# EasyEDA Pro project 重力怀表.epro, board PCB17
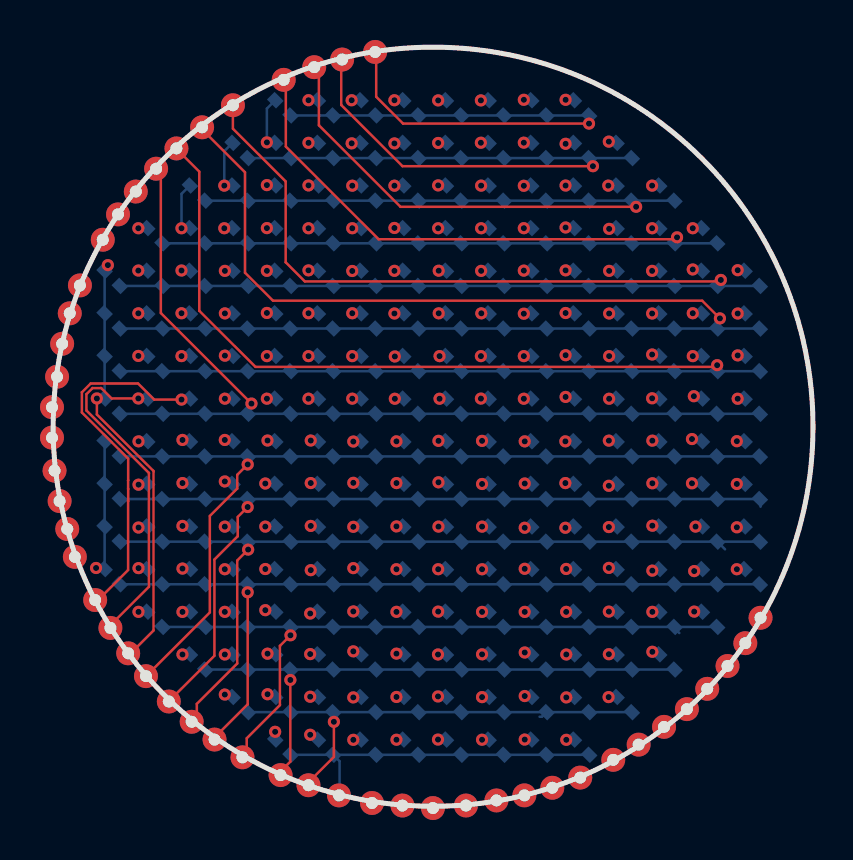
[diagram p3: board, top side]
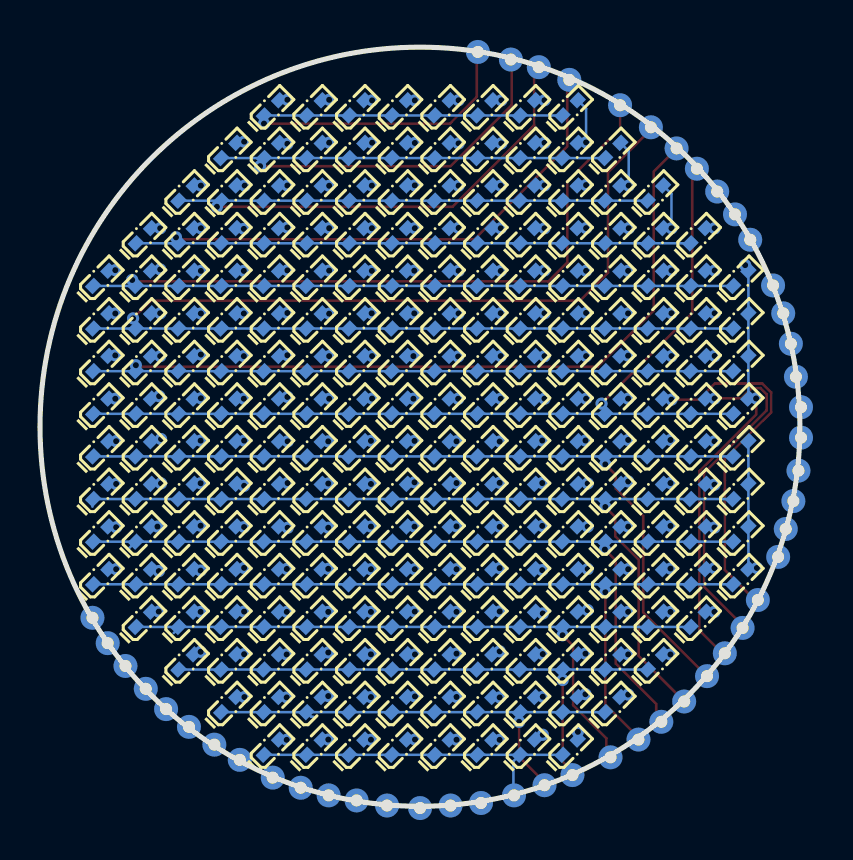
[diagram p4: board, bottom side, seen from below]

Outline 38 x 38 mm; copper layers: Top Layer, Inner1, Inner2, Bottom Layer. Coordinates in mm from the lower left corner of the outline.
Outline path: circle c19,19 r19
Stack: Top Layer 0.035mm / Dielectric1 1.51mm FR4 er 4.5 / Inner1 0.035mm / Dielectric2 0.48mm PP er 4.5 / Inner2 0.035mm / Dielectric3 0.48mm PP er 4.5 / Bottom Layer 0.035mm

## Design rules (mm)
template: JLCPCB Capability(Two Layers Board)
spacing copperThickness1oz (default): track to track 0.102, other pairs 0.152 to 0.3
spacing copperThickness2oz: track to track 0.203, other pairs 0.152 to 0.3
track width copperThickness1oz (default): min 0.127, default 0.254, max 2.54
track width copperThickness2oz: min 0.203, default 0.254, max 2.54
differential pair differentialPair (default): width min 0.127, default 0.254, max 2.54; gap min 0.152, default 0.152
via viaSize (default): diameter min 0.5, default 0.61, max 10; hole min 0.3, default 0.305, max 6.3

## Placement (name value [footprint] x y rotation side)
LED5  -  [LED_0402]  26.43 34.96 135 bottom
LED6  -  [LED_0402]  24.29 34.96 135 bottom
LED7  -  [LED_0402]  22.16 34.96 135 bottom
LED8  -  [LED_0402]  20.02 34.96 135 bottom
LED9  -  [LED_0402]  17.89 34.96 135 bottom
LED10  -  [LED_0402]  15.76 34.96 135 bottom
LED11  -  [LED_0402]  13.62 34.96 135 bottom
LED12  -  [LED_0402]  11.49 34.96 135 bottom
LED20  -  [LED_0402]  28.56 32.83 135 bottom
LED21  -  [LED_0402]  26.43 32.83 135 bottom
LED22  -  [LED_0402]  24.29 32.83 135 bottom
LED23  -  [LED_0402]  22.16 32.83 135 bottom
LED24  -  [LED_0402]  20.02 32.83 135 bottom
LED25  -  [LED_0402]  17.89 32.83 135 bottom
LED26  -  [LED_0402]  15.76 32.83 135 bottom
LED27  -  [LED_0402]  13.62 32.83 135 bottom
LED28  -  [LED_0402]  11.49 32.83 135 bottom
LED29  -  [LED_0402]  9.36 32.83 135 bottom
LED35  -  [LED_0402]  30.69 30.7 135 bottom
LED36  -  [LED_0402]  28.56 30.7 135 bottom
LED37  -  [LED_0402]  26.43 30.7 135 bottom
LED38  -  [LED_0402]  24.29 30.7 135 bottom
LED39  -  [LED_0402]  22.16 30.7 135 bottom
LED40  -  [LED_0402]  20.02 30.7 135 bottom
LED41  -  [LED_0402]  17.89 30.7 135 bottom
LED42  -  [LED_0402]  15.76 30.7 135 bottom
LED43  -  [LED_0402]  13.62 30.7 135 bottom
LED44  -  [LED_0402]  11.49 30.7 135 bottom
LED45  -  [LED_0402]  9.36 30.7 135 bottom
LED46  -  [LED_0402]  7.22 30.7 135 bottom
LED50  -  [LED_0402]  32.83 28.56 135 bottom
LED51  -  [LED_0402]  30.69 28.56 135 bottom
LED52  -  [LED_0402]  28.56 28.56 135 bottom
LED53  -  [LED_0402]  26.43 28.56 135 bottom
LED54  -  [LED_0402]  24.29 28.56 135 bottom
LED55  -  [LED_0402]  22.16 28.56 135 bottom
LED56  -  [LED_0402]  20.02 28.56 135 bottom
LED57  -  [LED_0402]  17.89 28.56 135 bottom
LED58  -  [LED_0402]  15.76 28.56 135 bottom
LED59  -  [LED_0402]  13.62 28.56 135 bottom
LED60  -  [LED_0402]  11.49 28.56 135 bottom
LED61  -  [LED_0402]  9.36 28.56 135 bottom
LED62  -  [LED_0402]  7.22 28.56 135 bottom
LED63  -  [LED_0402]  5.09 28.56 135 bottom
LED65  -  [LED_0402]  34.96 26.43 135 bottom
LED66  -  [LED_0402]  32.83 26.43 135 bottom
LED67  -  [LED_0402]  30.69 26.43 135 bottom
LED68  -  [LED_0402]  28.56 26.43 135 bottom
LED69  -  [LED_0402]  26.43 26.43 135 bottom
LED70  -  [LED_0402]  24.29 26.43 135 bottom
LED71  -  [LED_0402]  22.16 26.43 135 bottom
LED72  -  [LED_0402]  20.02 26.43 135 bottom
LED73  -  [LED_0402]  17.89 26.43 135 bottom
LED74  -  [LED_0402]  15.76 26.43 135 bottom
LED75  -  [LED_0402]  13.62 26.43 135 bottom
LED76  -  [LED_0402]  11.49 26.43 135 bottom
LED77  -  [LED_0402]  9.36 26.43 135 bottom
LED78  -  [LED_0402]  7.22 26.43 135 bottom
LED79  -  [LED_0402]  5.09 26.43 135 bottom
LED80  -  [LED_0402]  2.96 26.43 135 bottom
LED81  -  [LED_0402]  34.96 24.3 135 bottom
LED82  -  [LED_0402]  32.83 24.3 135 bottom
LED83  -  [LED_0402]  30.69 24.3 135 bottom
LED84  -  [LED_0402]  28.56 24.3 135 bottom
LED85  -  [LED_0402]  26.43 24.3 135 bottom
LED86  -  [LED_0402]  24.29 24.3 135 bottom
LED87  -  [LED_0402]  22.16 24.3 135 bottom
LED88  -  [LED_0402]  20.02 24.3 135 bottom
LED89  -  [LED_0402]  17.89 24.3 135 bottom
LED90  -  [LED_0402]  15.76 24.3 135 bottom
LED91  -  [LED_0402]  13.62 24.3 135 bottom
LED92  -  [LED_0402]  11.49 24.3 135 bottom
LED93  -  [LED_0402]  9.36 24.3 135 bottom
LED94  -  [LED_0402]  7.22 24.3 135 bottom
LED95  -  [LED_0402]  5.09 24.3 135 bottom
LED96  -  [LED_0402]  2.96 24.3 135 bottom
LED97  -  [LED_0402]  34.96 22.16 135 bottom
LED98  -  [LED_0402]  32.83 22.16 135 bottom
LED99  -  [LED_0402]  30.69 22.16 135 bottom
LED100  -  [LED_0402]  28.56 22.16 135 bottom
LED101  -  [LED_0402]  26.43 22.16 135 bottom
LED102  -  [LED_0402]  24.29 22.16 135 bottom
LED103  -  [LED_0402]  22.16 22.16 135 bottom
LED104  -  [LED_0402]  20.02 22.16 135 bottom
LED105  -  [LED_0402]  17.89 22.16 135 bottom
LED106  -  [LED_0402]  15.76 22.16 135 bottom
LED107  -  [LED_0402]  13.62 22.16 135 bottom
LED108  -  [LED_0402]  11.49 22.16 135 bottom
LED109  -  [LED_0402]  9.36 22.16 135 bottom
LED110  -  [LED_0402]  7.22 22.16 135 bottom
LED111  -  [LED_0402]  5.09 22.16 135 bottom
LED112  -  [LED_0402]  2.96 22.16 135 bottom
LED113  -  [LED_0402]  34.96 20.03 135 bottom
LED114  -  [LED_0402]  32.83 20.03 135 bottom
LED115  -  [LED_0402]  30.69 20.03 135 bottom
LED116  -  [LED_0402]  28.56 20.03 135 bottom
LED117  -  [LED_0402]  26.43 20.03 135 bottom
LED118  -  [LED_0402]  24.29 20.03 135 bottom
LED119  -  [LED_0402]  22.16 20.03 135 bottom
LED120  -  [LED_0402]  20.02 20.03 135 bottom
LED121  -  [LED_0402]  17.89 20.03 135 bottom
LED122  -  [LED_0402]  15.76 20.03 135 bottom
LED123  -  [LED_0402]  13.62 20.03 135 bottom
LED124  -  [LED_0402]  11.49 20.03 135 bottom
LED125  -  [LED_0402]  9.36 20.03 135 bottom
LED126  -  [LED_0402]  7.22 20.03 135 bottom
LED127  -  [LED_0402]  5.09 20.03 135 bottom
LED128  -  [LED_0402]  2.96 20.03 135 bottom
LED129  -  [LED_0402]  34.96 17.89 135 bottom
LED130  -  [LED_0402]  32.83 17.89 135 bottom
LED131  -  [LED_0402]  30.69 17.89 135 bottom
LED132  -  [LED_0402]  28.56 17.89 135 bottom
LED133  -  [LED_0402]  26.43 17.89 135 bottom
LED134  -  [LED_0402]  24.29 17.89 135 bottom
LED135  -  [LED_0402]  22.16 17.89 135 bottom
LED136  -  [LED_0402]  20.02 17.89 135 bottom
LED137  -  [LED_0402]  17.89 17.89 135 bottom
LED138  -  [LED_0402]  15.76 17.89 135 bottom
LED139  -  [LED_0402]  13.62 17.89 135 bottom
LED140  -  [LED_0402]  11.49 17.89 135 bottom
LED141  -  [LED_0402]  9.36 17.89 135 bottom
LED142  -  [LED_0402]  7.22 17.89 135 bottom
LED143  -  [LED_0402]  5.09 17.89 135 bottom
LED144  -  [LED_0402]  2.96 17.89 135 bottom
LED145  -  [LED_0402]  34.96 15.76 135 bottom
LED146  -  [LED_0402]  32.83 15.76 135 bottom
LED147  -  [LED_0402]  30.69 15.76 135 bottom
LED148  -  [LED_0402]  28.56 15.76 135 bottom
LED149  -  [LED_0402]  26.43 15.76 135 bottom
LED150  -  [LED_0402]  24.29 15.76 135 bottom
LED151  -  [LED_0402]  22.16 15.76 135 bottom
LED152  -  [LED_0402]  20.02 15.76 135 bottom
LED153  -  [LED_0402]  17.89 15.76 135 bottom
LED154  -  [LED_0402]  15.76 15.76 135 bottom
LED155  -  [LED_0402]  13.62 15.76 135 bottom
LED156  -  [LED_0402]  11.49 15.76 135 bottom
LED157  -  [LED_0402]  9.36 15.76 135 bottom
LED158  -  [LED_0402]  7.22 15.76 135 bottom
LED159  -  [LED_0402]  5.09 15.76 135 bottom
LED160  -  [LED_0402]  2.96 15.76 135 bottom
LED161  -  [LED_0402]  34.96 13.63 135 bottom
LED162  -  [LED_0402]  32.83 13.63 135 bottom
LED163  -  [LED_0402]  30.69 13.63 135 bottom
LED164  -  [LED_0402]  28.56 13.63 135 bottom
LED165  -  [LED_0402]  26.43 13.63 135 bottom
LED166  -  [LED_0402]  24.29 13.63 135 bottom
LED167  -  [LED_0402]  22.16 13.63 135 bottom
LED168  -  [LED_0402]  20.02 13.63 135 bottom
LED169  -  [LED_0402]  17.89 13.63 135 bottom
LED170  -  [LED_0402]  15.76 13.63 135 bottom
LED171  -  [LED_0402]  13.62 13.63 135 bottom
LED172  -  [LED_0402]  11.49 13.63 135 bottom
LED173  -  [LED_0402]  9.36 13.63 135 bottom
LED174  -  [LED_0402]  7.22 13.63 135 bottom
LED175  -  [LED_0402]  5.09 13.63 135 bottom
LED176  -  [LED_0402]  2.96 13.63 135 bottom
LED177  -  [LED_0402]  34.96 11.49 135 bottom
LED178  -  [LED_0402]  32.83 11.49 135 bottom
LED179  -  [LED_0402]  30.69 11.49 135 bottom
LED180  -  [LED_0402]  28.56 11.49 135 bottom
LED181  -  [LED_0402]  26.43 11.49 135 bottom
LED182  -  [LED_0402]  24.29 11.49 135 bottom
LED183  -  [LED_0402]  22.16 11.49 135 bottom
LED184  -  [LED_0402]  20.02 11.49 135 bottom
LED185  -  [LED_0402]  17.89 11.49 135 bottom
LED186  -  [LED_0402]  15.76 11.49 135 bottom
LED187  -  [LED_0402]  13.62 11.49 135 bottom
LED188  -  [LED_0402]  11.49 11.49 135 bottom
LED189  -  [LED_0402]  9.36 11.49 135 bottom
LED190  -  [LED_0402]  7.22 11.49 135 bottom
LED191  -  [LED_0402]  5.09 11.49 135 bottom
LED192  -  [LED_0402]  2.96 11.49 135 bottom
LED194  -  [LED_0402]  32.83 9.36 135 bottom
LED195  -  [LED_0402]  30.69 9.36 135 bottom
LED196  -  [LED_0402]  28.56 9.36 135 bottom
LED197  -  [LED_0402]  26.43 9.36 135 bottom
LED198  -  [LED_0402]  24.29 9.36 135 bottom
LED199  -  [LED_0402]  22.16 9.36 135 bottom
LED200  -  [LED_0402]  20.02 9.36 135 bottom
LED201  -  [LED_0402]  17.89 9.36 135 bottom
LED202  -  [LED_0402]  15.76 9.36 135 bottom
LED203  -  [LED_0402]  13.62 9.36 135 bottom
LED204  -  [LED_0402]  11.49 9.36 135 bottom
LED205  -  [LED_0402]  9.36 9.36 135 bottom
LED206  -  [LED_0402]  7.22 9.36 135 bottom
LED207  -  [LED_0402]  5.09 9.36 135 bottom
LED211  -  [LED_0402]  30.69 7.23 135 bottom
LED212  -  [LED_0402]  28.56 7.23 135 bottom
LED213  -  [LED_0402]  26.43 7.23 135 bottom
LED214  -  [LED_0402]  24.29 7.23 135 bottom
LED215  -  [LED_0402]  22.16 7.23 135 bottom
LED216  -  [LED_0402]  20.02 7.23 135 bottom
LED217  -  [LED_0402]  17.89 7.23 135 bottom
LED218  -  [LED_0402]  15.76 7.23 135 bottom
LED219  -  [LED_0402]  13.62 7.23 135 bottom
LED220  -  [LED_0402]  11.49 7.23 135 bottom
LED221  -  [LED_0402]  9.36 7.23 135 bottom
LED222  -  [LED_0402]  7.22 7.23 135 bottom
LED228  -  [LED_0402]  28.56 5.09 135 bottom
LED229  -  [LED_0402]  26.43 5.09 135 bottom
LED230  -  [LED_0402]  24.29 5.09 135 bottom
LED231  -  [LED_0402]  22.16 5.09 135 bottom
LED232  -  [LED_0402]  20.02 5.09 135 bottom
LED233  -  [LED_0402]  17.89 5.09 135 bottom
LED234  -  [LED_0402]  15.76 5.09 135 bottom
LED235  -  [LED_0402]  13.62 5.09 135 bottom
LED236  -  [LED_0402]  11.49 5.09 135 bottom
LED237  -  [LED_0402]  9.36 5.09 135 bottom
LED245  -  [LED_0402]  26.43 2.96 135 bottom
LED246  -  [LED_0402]  24.29 2.96 135 bottom
LED247  -  [LED_0402]  22.16 2.96 135 bottom
LED248  -  [LED_0402]  20.02 2.96 135 bottom
LED249  -  [LED_0402]  17.89 2.96 135 bottom
LED250  -  [LED_0402]  15.76 2.96 135 bottom
LED251  -  [LED_0402]  13.62 2.96 135 bottom
LED252  -  [LED_0402]  11.49 2.96 135 bottom
NOREF  -  [Pad_e873]  2.87 8.93 0 top
NOREF#2  -  [Pad_e881]  6.93 4.23 0 top
NOREF#3  -  [Pad_e874]  3.25 29.63 0 top
NOREF#4  -  [Pad_e872]  2.48 28.36 0 top
NOREF#5  -  [Pad_e898]  23.57 0.55 0 top
NOREF#6  -  [Pad_e894]  17.47 0.04 0 top
NOREF#7  -  [Pad_e884]  8.99 35.09 0 top
NOREF#8  -  [Pad_e870]  1.34 26.07 0 top
NOREF#9  -  [Pad_e887]  11.53 36.36 0 top
NOREF#10  -  [Pad_e878]  5.15 31.92 0 top
NOREF#11  -  [Pad_e902]  29.28 3.09 0 top
NOREF#12  -  [Pad_e895]  18.99 -0.09 0 top
NOREF#13  -  [Pad_e885]  9.47 2.45 0 top
NOREF#14  -  [Pad_e868]  0.83 24.68 0 top
NOREF#15  -  [Pad_e882]  7.45 33.99 0 top
NOREF#16  -  [Pad_e863]  0.07 16.8 0 top
NOREF#17  -  [Pad_e871]  2.1 10.33 0 top
NOREF#18  -  [Pad_e907]  34.62 8.17 0 top
NOREF#19  -  [Pad_e867]  0.71 13.88 0 top
NOREF#20  -  [Pad_e899]  24.96 0.93 0 top
NOREF#21  -  [Pad_e880]  6.17 32.93 0 top
NOREF#22  -  [Pad_e865]  0.33 15.28 0 top
NOREF#23  -  [Pad_e861]  -0.06 19.98 0 top
NOREF#24  -  [Pad_e886]  11.37 1.56 0 top
NOREF#25  -  [Pad_e892]  15.95 0.17 0 top
NOREF#26  -  [Pad_e893]  16.1 37.76 0 top
NOREF#27  -  [Pad_e862]  -0.06 18.45 0 top
NOREF#28  -  [Pad_e903]  30.55 3.98 0 top
NOREF#29  -  [Pad_e866]  0.45 23.15 0 top
NOREF#30  -  [Pad_e901]  28.01 2.32 0 top
NOREF#31  -  [Pad_e900]  26.36 1.44 0 top
NOREF#32  -  [Pad_e883]  8.07 3.34 0 top
NOREF#33  -  [Pad_e889]  13.06 37 0 top
NOREF#34  -  [Pad_e869]  1.09 12.48 0 top
NOREF#35  -  [Pad_e888]  12.77 1.05 0 top
NOREF#36  -  [Pad_e864]  0.2 21.5 0 top
NOREF#37  -  [Pad_e906]  33.73 7.02 0 top
NOREF#38  -  [Pad_e905]  32.71 5.88 0 top
NOREF#39  -  [Pad_e896]  20.65 0.04 0 top
NOREF#40  -  [Pad_e904]  31.69 4.86 0 top
NOREF#41  -  [Pad_e890]  14.3 0.55 0 top
NOREF#42  -  [Pad_e877]  4.64 6.52 0 top
NOREF#43  -  [Pad_e908]  35.38 9.44 0 top
NOREF#44  -  [Pad_e879]  5.79 5.25 0 top
NOREF#45  -  [Pad_e891]  14.45 37.38 0 top
NOREF#46  -  [Pad_e875]  3.75 7.66 0 top
NOREF#47  -  [Pad_e876]  4.14 30.77 0 top
NOREF#48  -  [Pad_e897]  22.17 0.29 0 top

## Footprints (pads in the part's own frame, mm; a bottom-side part is the same pattern mirrored in y, then rotated)
LED_0402
  rect 0.637x0.541 smd: 1(-0.538,0) 2(0.538,0)
Pad_e861
  round 1.2 hole 0.6: 8(0,0)
Pad_e862
  round 1.2 hole 0.6: 7(0,0)
Pad_e863
  round 1.2 hole 0.6: 6(0,0)
Pad_e864
  round 1.2 hole 0.6: 9(0,0)
Pad_e865
  round 1.2 hole 0.6: 5(0,0)
Pad_e866
  round 1.2 hole 0.6: 10(0,0)
Pad_e867
  round 1.2 hole 0.6: 4(0,0)
Pad_e868
  round 1.2 hole 0.6: 11(0,0)
Pad_e869
  round 1.2 hole 0.6: 3(0,0)
Pad_e870
  round 1.2 hole 0.6: 12(0,0)
Pad_e871
  round 1.2 hole 0.6: 2(0,0)
Pad_e872
  round 1.2 hole 0.6: 13(0,0)
Pad_e873
  round 1.2 hole 0.6: 1(0,0)
Pad_e874
  round 1.2 hole 0.6: 14(0,0)
Pad_e875
  round 1.2 hole 0.6: 1(0,0)
Pad_e876
  round 1.2 hole 0.6: 15(0,0)
Pad_e877
  round 1.2 hole 0.6: 5(0,0)
Pad_e878
  round 1.2 hole 0.6: 1(0,0)
Pad_e879
  round 1.2 hole 0.6: 4(0,0)
Pad_e880
  round 1.2 hole 0.6: 2(0,0)
Pad_e881
  round 1.2 hole 0.6: 3(0,0)
Pad_e882
  round 1.2 hole 0.6: 3(0,0)
Pad_e883
  round 1.2 hole 0.6: 2(0,0)
Pad_e884
  round 1.2 hole 0.6: 4(0,0)
Pad_e885
  round 1.2 hole 0.6: 1(0,0)
Pad_e886
  round 1.2 hole 0.6: 3(0,0)
Pad_e887
  round 1.2 hole 0.6: 5(0,0)
Pad_e888
  round 1.2 hole 0.6: 2(0,0)
Pad_e889
  round 1.2 hole 0.6: 6(0,0)
Pad_e890
  round 1.2 hole 0.6: 1(0,0)
Pad_e891
  round 1.2 hole 0.6: 7(0,0)
Pad_e892
  round 1.2 hole 0.6: 15(0,0)
Pad_e893
  round 1.2 hole 0.6: 8(0,0)
Pad_e894
  round 1.2 hole 0.6: 14(0,0)
Pad_e895
  round 1.2 hole 0.6: 13(0,0)
Pad_e896
  round 1.2 hole 0.6: 12(0,0)
Pad_e897
  round 1.2 hole 0.6: 11(0,0)
Pad_e898
  round 1.2 hole 0.6: 10(0,0)
Pad_e899
  round 1.2 hole 0.6: 9(0,0)
Pad_e900
  round 1.2 hole 0.6: 8(0,0)
Pad_e901
  round 1.2 hole 0.6: 7(0,0)
Pad_e902
  round 1.2 hole 0.6: 6(0,0)
Pad_e903
  round 1.2 hole 0.6: 5(0,0)
Pad_e904
  round 1.2 hole 0.6: 4(0,0)
Pad_e905
  round 1.2 hole 0.6: 3(0,0)
Pad_e906
  round 1.2 hole 0.6: 2(0,0)
Pad_e907
  round 1.2 hole 0.6: 2(0,0)
Pad_e908
  round 1.2 hole 0.6: 1(0,0)

## Nets
2R0: LED129.2 LED145.2 LED161.2 LED177.2 NOREF#43.1
2R1: LED130.2 LED146.2 LED162.2 LED178.2 LED194.2 NOREF#18.2
2R2: LED131.2 LED147.2 LED163.2 LED179.2 LED195.2 LED211.2 NOREF#37.2
2R3: LED132.2 LED148.2 LED164.2 LED180.2 LED196.2 LED212.2 LED228.2 NOREF#38.3
2R4: LED133.2 LED149.2 LED165.2 LED181.2 LED197.2 LED213.2 LED229.2 LED245.2 NOREF#40.4
2R5: LED134.2 LED150.2 LED166.2 LED182.2 LED198.2 LED214.2 LED230.2 LED246.2 NOREF#28.5
2R6: LED135.2 LED151.2 LED167.2 LED183.2 LED199.2 LED215.2 LED231.2 LED247.2 NOREF#11.6
2R7: LED136.2 LED152.2 LED168.2 LED184.2 LED200.2 LED216.2 LED232.2 LED248.2 NOREF#30.7
2R8: LED137.2 LED153.2 LED169.2 LED185.2 LED201.2 LED217.2 LED233.2 LED249.2 NOREF#31.8
2R9: LED138.2 LED154.2 LED170.2 LED186.2 LED202.2 LED218.2 LED234.2 LED250.2 NOREF#20.9
2R10: LED139.2 LED155.2 LED171.2 LED187.2 LED203.2 LED219.2 LED235.2 LED251.2 NOREF#5.10
2R11: LED140.2 LED156.2 LED172.2 LED188.2 LED204.2 LED220.2 LED236.2 LED252.2 NOREF#48.11
2R12: LED141.2 LED157.2 LED173.2 LED189.2 LED205.2 LED221.2 LED237.2 NOREF#39.12
2R13: LED142.2 LED158.2 LED174.2 LED190.2 LED206.2 LED222.2 NOREF#12.13
2R14: LED143.2 LED159.2 LED175.2 LED191.2 LED207.2 NOREF#6.14
2R15: LED144.2 LED160.2 LED176.2 LED192.2 NOREF#25.15
C0: LED5.1 LED6.1 LED7.1 LED8.1 LED9.1 LED10.1 LED11.1 LED12.1 NOREF#26.8
C1: LED20.1 LED21.1 LED22.1 LED23.1 LED24.1 LED25.1 LED26.1 LED27.1 LED28.1 LED29.1 NOREF#45.7
C2: LED35.1 LED36.1 LED37.1 LED38.1 LED39.1 LED40.1 LED41.1 LED42.1 LED43.1 LED44.1 LED45.1 LED46.1 NOREF#33.6
C3: LED50.1 LED51.1 LED52.1 LED53.1 LED54.1 LED55.1 LED56.1 LED57.1 LED58.1 LED59.1 LED60.1 LED61.1 LED62.1 LED63.1 NOREF#9.5
C4: LED65.1 LED66.1 LED67.1 LED68.1 LED69.1 LED70.1 LED71.1 LED72.1 LED73.1 LED74.1 LED75.1 LED76.1 LED77.1 LED78.1 LED79.1 LED80.1 NOREF#7.4
C5: LED81.1 LED82.1 LED83.1 LED84.1 LED85.1 LED86.1 LED87.1 LED88.1 LED89.1 LED90.1 LED91.1 LED92.1 LED93.1 LED94.1 LED95.1 LED96.1 NOREF#15.3
C6: LED97.1 LED98.1 LED99.1 LED100.1 LED101.1 LED102.1 LED103.1 LED104.1 LED105.1 LED106.1 LED107.1 LED108.1 LED109.1 LED110.1 LED111.1 LED112.1 NOREF#21.2
C7: LED113.1 LED114.1 LED115.1 LED116.1 LED117.1 LED118.1 LED119.1 LED120.1 LED121.1 LED122.1 LED123.1 LED124.1 LED125.1 LED126.1 LED127.1 LED128.1 NOREF#10.1
C8: LED129.1 LED130.1 LED131.1 LED132.1 LED133.1 LED134.1 LED135.1 LED136.1 LED137.1 LED138.1 LED139.1 LED140.1 LED141.1 LED142.1 LED143.1 LED144.1 NOREF#42.5
C9: LED145.1 LED146.1 LED147.1 LED148.1 LED149.1 LED150.1 LED151.1 LED152.1 LED153.1 LED154.1 LED155.1 LED156.1 LED157.1 LED158.1 LED159.1 LED160.1 NOREF#44.4
C10: LED161.1 LED162.1 LED163.1 LED164.1 LED165.1 LED166.1 LED167.1 LED168.1 LED169.1 LED170.1 LED171.1 LED172.1 LED173.1 LED174.1 LED175.1 LED176.1 NOREF#2.3
C11: LED177.1 LED178.1 LED179.1 LED180.1 LED181.1 LED182.1 LED183.1 LED184.1 LED185.1 LED186.1 LED187.1 LED188.1 LED189.1 LED190.1 LED191.1 LED192.1 NOREF#32.2
C12: LED194.1 LED195.1 LED196.1 LED197.1 LED198.1 LED199.1 LED200.1 LED201.1 LED202.1 LED203.1 LED204.1 LED205.1 LED206.1 LED207.1 NOREF#13.1
C13: LED211.1 LED212.1 LED213.1 LED214.1 LED215.1 LED216.1 LED217.1 LED218.1 LED219.1 LED220.1 LED221.1 LED222.1 NOREF#24.3
C14: LED228.1 LED229.1 LED230.1 LED231.1 LED232.1 LED233.1 LED234.1 LED235.1 LED236.1 LED237.1 NOREF#35.2
C15: LED245.1 LED246.1 LED247.1 LED248.1 LED249.1 LED250.1 LED251.1 LED252.1 NOREF#41.1
R0: LED65.2 LED81.2 LED97.2 LED113.2 NOREF#47.15
R1: LED50.2 LED66.2 LED82.2 LED98.2 LED114.2 NOREF#3.14
R2: LED35.2 LED51.2 LED67.2 LED83.2 LED99.2 LED115.2 NOREF#4.13
R3: LED20.2 LED36.2 LED52.2 LED68.2 LED84.2 LED100.2 LED116.2 NOREF#8.12
R4: LED5.2 LED21.2 LED37.2 LED53.2 LED69.2 LED85.2 LED101.2 LED117.2 NOREF#14.11
R5: LED6.2 LED22.2 LED38.2 LED54.2 LED70.2 LED86.2 LED102.2 LED118.2 NOREF#29.10
R6: LED7.2 LED23.2 LED39.2 LED55.2 LED71.2 LED87.2 LED103.2 LED119.2 NOREF#36.9
R7: LED8.2 LED24.2 LED40.2 LED56.2 LED72.2 LED88.2 LED104.2 LED120.2 NOREF#23.8
R8: LED9.2 LED25.2 LED41.2 LED57.2 LED73.2 LED89.2 LED105.2 LED121.2 NOREF#27.7
R9: LED10.2 LED26.2 LED42.2 LED58.2 LED74.2 LED90.2 LED106.2 LED122.2 NOREF#16.6
R10: LED11.2 LED27.2 LED43.2 LED59.2 LED75.2 LED91.2 LED107.2 LED123.2 NOREF#22.5
R11: LED12.2 LED28.2 LED44.2 LED60.2 LED76.2 LED92.2 LED108.2 LED124.2 NOREF#19.4
R12: LED29.2 LED45.2 LED61.2 LED77.2 LED93.2 LED109.2 LED125.2 NOREF#34.3
R13: LED46.2 LED62.2 LED78.2 LED94.2 LED110.2 LED126.2 NOREF#17.2
R14: LED63.2 LED79.2 LED95.2 LED111.2 LED127.2 NOREF.1
R15: LED80.2 LED96.2 LED112.2 LED128.2 NOREF#46.1

## Via types
v1: diameter 0.61, hole 0.305, Top Layer to Bottom Layer, 223 vias

## Routing (per net, layer and track width the routed paths; a pad name or vN(x,y) marks a point on that pad's centre or on a via; arc(x,y) is an arc through that point)
2R0: length 9.1
  Inner1 w0.127: 35.07,9.54 34.19,10.42 v1(34.19,11.87)
  Inner2 w0.127: v1(34.19,11.87) v1(34.19,13.97) v1(34.19,16.14) v1(34.19,18.28)
2R1: length 11.6
  Inner1 w0.127: 34.4,8.48 33.33,8.48 v1(32.06,9.75)
  Inner2 w0.127: v1(32.06,9.75) 31.95,9.86 v1(31.95,16.17) v1(31.95,18.38)
  vias: v1(32.06,11.77) v1(32.13,14)
2R2: length 14.3
  Inner1 w0.127: 33.42,7.17 30.53,7.17 v1(29.97,7.73)
  Inner2 w0.127: v1(29.97,18.3) v1(29.97,16.17) v1(29.97,14.05) v1(29.97,11.8) v1(29.97,9.73) v1(29.97,7.73)
2R3: length 18
  Inner1 w0.127: 32.36,5.97 29.88,5.97 28.9,4.99 28.25,4.99 v1(27.78,5.47)
  Inner2 w0.127: v1(27.78,5.47) 27.79,5.48 v1(27.79,7.61) v1(27.79,9.75) v1(27.79,11.93) v1(27.79,13.98) v1(27.79,16.04) v1(27.79,18.3)
2R4: length 20.9
  Inner1 w0.127: v1(25.66,5.45) 26.76,4.36 ; 26.76,4.36 26.69,4.36 v1(25.66,3.33) ; 26.76,4.36 28.65,4.36 29.41,5.12 31.47,5.12
  Inner2 w0.127: v1(25.62,18.27) 25.66,18.22 v1(25.66,7.6) v1(25.66,5.45)
  vias: v1(25.62,16.18) v1(25.62,13.94) v1(25.66,11.88) v1(25.66,9.73)
2R5: length 22.5
  Inner1 w0.127: v1(23.58,3.34) 24.12,2.81 25.95,2.81 27.27,4.13 30.12,4.13 30.2,4.2 30.38,4.2
  Inner2 w0.127: v1(23.58,3.34) v1(23.58,5.52) v1(23.58,7.7) v1(23.58,9.73) v1(23.58,11.89) v1(23.58,13.94) v1(23.58,16.16) v1(23.58,18.27)
2R6: length 23.3
  Inner1 w0.127: v1(21.45,3.33) 22.21,2.58 26.05,2.58 26.79,3.32 29.13,3.32
  Inner2 w0.127: v1(21.45,18.29) v1(21.45,16.13) v1(21.45,14) v1(21.45,11.87) v1(21.45,9.73) v1(21.45,7.61) v1(21.45,5.47) v1(21.45,3.33)
2R7: length 24.3
  Inner1 w0.127: 27.87,2.58 26.37,2.58 26.14,2.35 19.83,2.35 19.25,2.93 v1(19.25,3.34)
  Inner2 w0.127: v1(19.25,3.34) 19.27,3.36 v1(19.27,14) v1(19.27,16.22) v1(19.27,18.29)
  vias: v1(19.26,11.87) v1(19.26,9.75) v1(19.25,7.6) v1(19.25,5.5)
2R8: length 24.6
  Inner1 w0.127: v1(17.17,3.33) 18.38,2.12 25.88,2.12 26.22,1.78
  Inner2 w0.127: v1(17.17,18.27) v1(17.17,16.18) v1(17.17,14.01) v1(17.17,11.87) v1(17.17,9.73) v1(17.17,7.64) v1(17.17,5.47) v1(17.17,3.33)
2R9: length 25.6
  Inner1 w0.127: 24.85,1.27 24.23,1.89 17.88,1.89 16.44,3.33 v1(15.01,3.33)
  Inner2 w0.127: v1(15.01,3.33) v1(15.01,5.45) v1(15.01,7.76) v1(15.01,9.75) v1(15.01,11.92) v1(15.01,13.99) v1(15.01,16.19) v1(15.01,18.26)
2R10: length 26.5
  Inner1 w0.127: v1(12.86,3.58) 13.22,3.21 14.39,3.21 14.8,2.81 16.64,2.81 17.78,1.66 22.7,1.66 23.48,0.87
  Inner2 w0.127: v1(12.86,3.58) v1(12.86,5.48) v1(12.86,7.62) v1(12.86,9.65) 12.86,18.28 v1(12.88,18.31)
  vias: v1(12.88,16.18) v1(12.88,14.03) v1(12.88,11.82)
2R11: length 27.1
  Inner1 w0.127: v1(11.1,3.73) 11.11,3.72 11.98,3.72 12.72,2.98 14.3,2.98 14.7,2.58 16.54,2.58 17.69,1.43 21.28,1.43 22.12,0.59
  Inner2 w0.127: v1(10.72,18.31) 10.72,4.11 v1(11.1,3.73)
  vias: v1(10.61,16.16) v1(10.61,14) v1(10.61,11.88) v1(10.61,9.82) v1(10.72,7.64) v1(10.72,5.61)
2R12: length 27
  Inner1 w0.127: v1(8.59,5.59) 8.59,5.51 10.89,3.21 12.17,3.21 12.62,2.76 14.2,2.76 14.61,2.35 16.45,2.35 17.59,1.2 19.81,1.2 20.61,0.4
  Inner2 w0.127: v1(8.59,18.34) v1(8.59,16.26) v1(8.59,14) v1(8.59,11.87) v1(8.59,9.73) v1(8.59,7.6) v1(8.59,5.59)
2R13: length 26.7
  Inner1 w0.127: 18.99,0.33 18.34,0.97 17.5,0.97 16.35,2.12 14.47,2.12 14.06,2.53 12.53,2.53 12.08,2.98 10.79,2.98 8.74,5.03 8.29,5.03 6.47,6.85 v1(6.47,7.6)
  Inner2 w0.127: v1(6.47,18.34) v1(6.47,16.18) v1(6.47,14.03) v1(6.47,11.9) v1(6.47,9.73) v1(6.47,7.6)
2R14: length 26.4
  Inner1 w0.127: v1(4.27,9.73) 4.27,8.72 8.19,4.8 8.65,4.8 10.71,2.73 12,2.73 12.43,2.3 13.97,2.3 14.38,1.89 16.26,1.89 17.51,0.64 17.51,0.38
  Inner2 w0.127: v1(4.27,18.27) v1(4.27,16.1) v1(4.27,13.95) v1(4.27,11.92) v1(4.27,9.73)
2R15: length 26.1
  Inner1 w0.127: 16.01,0.57 16.01,1.12 15.47,1.66 14.28,1.66 13.87,2.07 12.34,2.07 11.9,2.5 10.62,2.5 8.55,4.57 8.1,4.57 4.04,8.63 4.04,9.23 3.63,9.64 3.63,10.45 v1(2.15,11.93)
  Bottom Layer w0.127: 2.58,11.87 LED160.2 LED144.2
C0: length 28
  Top Layer w0.127: 16.16,37.42 16.16,35.52 17.5,34.17 v1(26.8,34.17)
  Bottom Layer w0.127: 11.87,34.58 26.81,34.58
C1: length 35.1
  Top Layer w0.127: v1(27,32.04) 17.47,32.04 14.41,35.1 14.41,36.98 14.52,37.09
  Bottom Layer w0.127: LED29.1 LED28.1 LED27.1 LED26.1 LED25.1 LED24.1 LED23.1 LED22.1 LED21.1 LED20.1
C2: length 43.6
  Top Layer w0.127: 13.16,36.7 13.29,36.56 13.29,34.09 17.37,30.01 v1(29.15,30.01)
  Bottom Layer w0.127: 31,30.39 30.93,30.32 LED36.1 LED37.1 LED38.1 LED39.1 LED40.1 LED41.1 LED42.1 LED43.1 LED44.1 LED45.1 LED46.1
C3: length 52.4
  Top Layer w0.127: 11.64,36.12 11.64,33.02 16.28,28.38 31.1,28.38 v1(31.2,28.48)
  Bottom Layer w0.127: LED63.1 LED62.1 LED61.1 LED60.1 LED59.1 LED58.1 LED57.1 LED56.1 LED55.1 LED54.1 LED53.1 LED52.1 LED51.1 LED50.1
C4: length 63.1
  Top Layer w0.127: NOREF#7.4 8.99,33.92 11.63,31.28 11.63,27.23 12.59,26.28 33.32,26.28 v1(33.39,26.35)
  Bottom Layer w0.127: 35.34,26.05 3.34,26.05
C5: length 64.5
  Top Layer w0.127: v1(33.35,24.42) 32.46,25.31 10.99,25.31 9.6,26.71 9.6,31.74 7.61,33.72
  Bottom Layer w0.127: 3.34,23.91 35.34,23.91
C6: length 67.4
  Top Layer w0.127: v1(33.21,22.08) 33.12,22 10.12,22 7.31,24.8 7.31,31.77 6.39,32.69
  Bottom Layer w0.127: LED97.1 LED98.1 LED99.1 LED100.1 LED101.1 LED102.1 LED103.1 LED104.1 LED105.1 LED106.1 LED107.1 LED108.1 LED109.1 LED110.1 LED111.1 LED112.1
C7: length 45.4
  Top Layer w0.127: v1(9.92,20.16) 5.39,24.69 5.39,31.7
  Bottom Layer w0.127: LED113.1 LED114.1 LED115.1 LED116.1 LED117.1 LED118.1 LED119.1 LED120.1 LED121.1 LED122.1 LED123.1 LED124.1 LED125.1 LED126.1 LED127.1 LED128.1
C8: length 44.4
  Top Layer w0.127: 4.91,6.75 4.91,6.78 7.84,9.7 7.84,14.53 9.21,15.91 9.21,16.59 v1(9.73,17.11)
  Bottom Layer w0.127: LED144.1 LED143.1 LED142.1 LED141.1 LED140.1 LED139.1 LED138.1 LED137.1 LED136.1 LED135.1 LED134.1 LED133.1 LED132.1 LED131.1 LED130.1 LED129.1
C9: length 43.4
  Top Layer w0.127: 6.07,5.54 8.07,7.54 8.07,12.35 9.23,13.52 9.23,14.48 v1(9.73,14.98)
  Bottom Layer w0.127: 3.34,15.38 35.34,15.38 35.38,15.34 35.38,15
C10: length 41.9
  Top Layer w0.127: v1(9.75,12.85) 9.21,12.31 9.21,7.15 7.19,5.13 7.19,4.54
  Bottom Layer w0.127: 33.22,13.25 33.6,12.87 ; 33.22,13.25 3.34,13.25 ; 33.22,13.25 35.34,13.25
C11: length 39.8
  Top Layer w0.127: 8.32,3.69 9.73,5.1 v1(9.73,10.71)
  Bottom Layer w0.127: LED177.1 LED178.1 33.08,10.98 33.08,11.11 LED179.1 LED180.1 LED181.1 LED182.1 LED183.1 LED184.1 LED185.1 LED186.1 LED187.1 LED188.1 LED189.1 LED190.1 LED191.1 LED192.1
C12: length 34.8
  Top Layer w0.127: 9.68,2.82 9.68,3.4 11.34,5.06 11.34,8.03 v1(11.87,8.56)
  Bottom Layer w0.127: LED207.1 LED206.1 LED205.1 LED204.1 LED203.1 LED202.1 LED201.1 LED200.1 LED199.1 LED198.1 LED197.1 LED196.1 31.01,8.98 ; 31.01,8.98 31.31,8.67 ; 31.01,8.98 LED195.1 LED194.1
C13: length 28
  Top Layer w0.127: v1(11.86,6.33) 11.86,2.24 11.52,1.89
  Bottom Layer w0.127: LED211.1 LED212.1 LED213.1 LED214.1 LED215.1 LED216.1 LED217.1 LED218.1 LED219.1 LED220.1 LED221.1 LED222.1
C14: length 22.6
  Top Layer w0.127: v1(14.04,4.23) 14.04,2.47 12.92,1.34
  Bottom Layer w0.127: 28.94,4.71 24.67,4.71 24.44,4.48 24.33,4.48 ; 9.74,4.71 24.33,4.71
C15: length 16.7
  Bottom Layer w0.127: 14,2.58 26.81,2.58 ; 14,2.58 11.87,2.58 ; 14,2.58 14.33,2.26 14.33,0.92
R0: length 40.5
  Inner1 w0.127: 4.41,30.56 4.48,30.48 23.31,30.48 33.39,20.4 v1(34.23,20.4)
  Inner2 w0.127: v1(34.23,20.4) v1(34.23,22.57) v1(34.23,24.67) v1(34.23,26.84)
R1: length 40.7
  Inner1 w0.127: v1(32.04,20.53) 31.19,20.53 22.25,29.47 16.85,29.47 16.84,29.46 14.74,29.46 14.74,29.46 10.48,29.46 10.47,29.46 3.61,29.46 3.56,29.41
  Inner2 w0.127: 32.04,22.53 32.04,28.88 v1(31.99,28.94) ; v1(32.04,20.53) 31.99,20.58 v1(31.99,22.53)
  vias: v1(31.99,26.87) v1(31.99,24.68)
R2: length 41
  Inner1 w0.127: v1(29.95,20.42) 29.16,20.42 21.4,28.18 2.8,28.18
  Inner2 w0.127: v1(29.95,20.42) v1(29.95,22.61) v1(29.95,24.67) v1(29.95,26.8) v1(29.95,28.94) v1(29.95,31.07)
R3: length 41.3
  Inner1 w0.127: 1.71,25.93 2.5,25.93 3.25,25.18 4.03,25.18 4.05,25.2 6.2,25.2 6.21,25.2 10.46,25.2 10.48,25.22 21.61,25.22 24.77,22.06 26.15,22.06 v1(27.81,20.4)
  Inner2 w0.127: v1(27.81,20.4) v1(27.81,22.53) v1(27.81,24.67) v1(27.81,26.8) v1(27.81,28.9) 27.81,33.26 v1(27.79,33.27)
  vias: v1(27.76,31.07)
R4: length 41
  Inner1 w0.127: 1.22,24.56 2.99,24.56 4.01,23.54 21.8,23.54 24.85,20.49 v1(25.63,20.49)
  Inner2 w0.127: v1(25.63,20.49) v1(25.63,22.58) v1(25.63,24.69) v1(25.63,26.83) v1(25.63,28.97) v1(25.63,31.07) v1(25.63,33.16) v1(25.63,35.37)
R5: length 39
  Inner1 w0.127: 0.82,23.07 1.05,23.31 19.88,23.31 22.79,20.4 v1(23.54,20.4)
  Inner2 w0.127: v1(23.54,20.4) v1(23.54,22.53) v1(23.54,24.66) v1(23.54,26.82) v1(23.54,28.94) v1(23.54,31.06) v1(23.54,33.22) v1(23.54,35.37)
R6: length 37.6
  Inner1 w0.127: v1(21.39,20.41) 19.79,22.01 19.11,22.01 18.05,23.08 6.23,23.08 4.61,21.46 0.53,21.46
  Inner2 w0.127: v1(21.39,20.41) 21.39,20.41 v1(21.39,33.22) v1(21.39,35.33)
  vias: v1(21.4,31.07) v1(21.4,28.94) v1(21.4,26.8) v1(21.41,24.68) v1(21.39,22.53)
R7: length 35.3
  Inner1 w0.127: v1(19.33,20.4) 17.89,21.84 6.42,21.84 4.48,19.89 0.44,19.89 0.38,19.95
  Inner2 w0.127: v1(19.26,35.33) 19.33,35.27 v1(19.33,22.53) v1(19.33,20.4)
  vias: v1(19.26,33.2) v1(19.26,31.08) v1(19.26,28.94) v1(19.28,26.81) v1(19.28,24.68)
R8: length 33.6
  Inner1 w0.127: v1(17.09,20.4) 15.88,21.61 6.56,21.61 3.32,18.38 0.45,18.38 0.36,18.46
  Inner2 w0.127: v1(17.09,20.4) 17.07,20.42 v1(17.07,24.67) v1(17.07,26.8) v1(17.07,28.95) v1(17.07,31.07) v1(17.07,33.18) v1(17.07,35.34)
  vias: v1(17.09,22.52)
R9: length 31.7
  Inner1 w0.127: v1(14.96,20.4) 13.98,21.38 6.65,21.38 2.12,16.85 0.48,16.85
  Inner2 w0.127: v1(14.93,35.34) 14.96,35.31 v1(14.96,31.07) v1(14.96,28.94) v1(14.96,26.8) v1(14.96,24.68) v1(14.96,22.53) v1(14.96,20.4)
  vias: v1(14.93,33.19)
R10: length 29.7
  Inner1 w0.127: v1(12.77,20.4) 12.02,21.15 8.17,21.15 2.37,15.35 0.71,15.35
  Inner2 w0.127: v1(12.77,20.4) v1(12.77,22.53) v1(12.77,24.68) v1(12.77,26.83) v1(12.77,28.94) v1(12.77,31.08) v1(12.77,33.21) v1(12.77,35.34)
R11: length 27.9
  Inner1 w0.127: v1(10.69,20.4) 10.17,20.92 8.32,20.92 1.37,13.97 1.04,13.97
  Inner2 w0.127: v1(10.69,20.4) v1(10.69,22.53) v1(10.69,24.7) v1(10.69,26.8) v1(10.69,28.94) v1(10.69,31.1) v1(10.69,33.23)
  Bottom Layer w0.127: 11.11,35.34 10.69,34.93 v1(10.69,33.23)
R12: length 23.8
  Inner1 w0.127: 1.47,12.62 1.53,12.62 8.59,19.68 v1(8.59,20.4)
  Inner2 w0.127: v1(8.56,31.07) 8.59,31.04 v1(8.59,26.8) v1(8.59,24.67) v1(8.59,22.56) v1(8.59,20.4)
  Bottom Layer w0.127: v1(8.56,31.07) 8.56,32.8 8.98,33.21
  vias: v1(8.56,28.94)
R13: length 28.2
  Top Layer w0.127: 2.4,10.48 3.75,11.83 3.75,15.28 3.75,15.28 3.75,15.88 3.75,15.89 3.75,16.32 3.75,16.32 3.75,17.4 1.44,19.72 1.44,20.72 1.88,21.16 4.25,21.16 5.05,20.36 v1(6.42,20.36)
  Inner2 w0.127: v1(6.42,28.94) v1(6.42,26.82) v1(6.42,24.68) v1(6.42,22.53) v1(6.42,20.36)
  Bottom Layer w0.127: 6.84,31.08 6.42,30.66 v1(6.42,28.94)
R14: length 24.9
  Top Layer w0.127: v1(4.26,20.41) 2.92,20.41 2.4,20.94 1.97,20.94 1.67,20.63 1.67,19.81 4.79,16.69 4.79,10.99 3.17,9.37 3.17,9.12
  Inner2 w0.127: v1(4.26,20.41) v1(4.26,22.54) v1(4.26,24.68) v1(4.26,26.82) v1(4.26,28.94)
R15: length 20.6
  Top Layer w0.127: 4.03,7.86 4.08,7.86 5.02,8.8 5.02,16.78 2.19,19.61 v1(2.19,20.41)
  Bottom Layer w0.127: LED80.2 LED128.2
  vias: v1(2.74,27.09)
